# Altium schematic sheet GSHT_V1.4.SchDoc
size A4
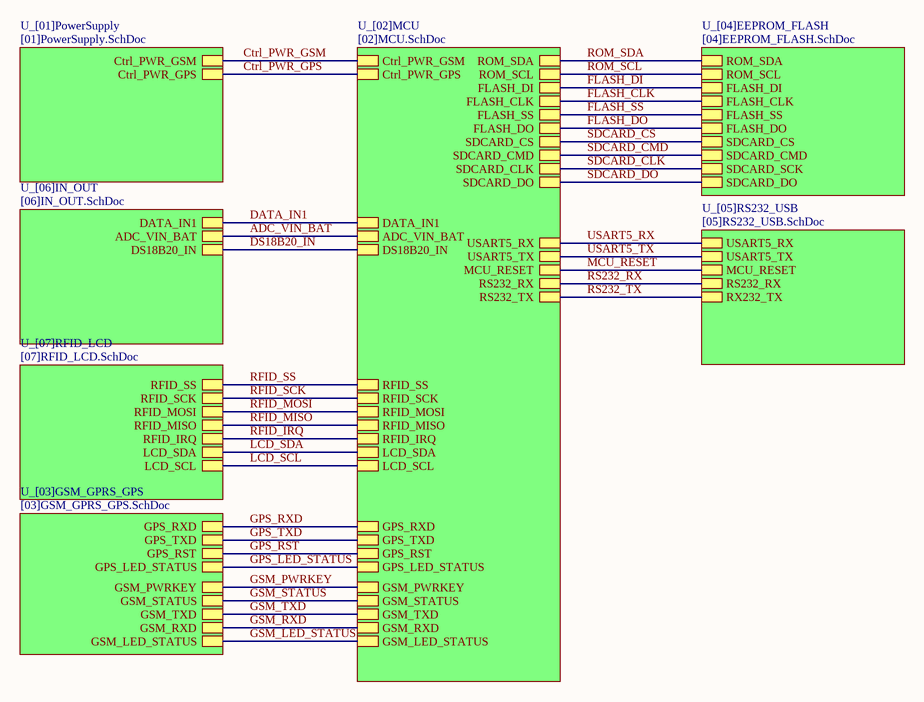
[diagram p0: GSHT_V1.4.SchDoc]

## Sub-sheets
U_[01]PowerSupply = [01]PowerSupply.SchDoc: Ctrl_PWR_GSM, Ctrl_PWR_GPS
U_[02]MCU = [02]MCU.SchDoc: GSM_STATUS, GSM_PWRKEY, DATA_IN1, GPS_RXD, GPS_TXD, GPS_RST, Ctrl_PWR_GPS, GSM_RXD, GSM_TXD, Ctrl_PWR_GSM, GSM_LED_STATUS, RS232_TX, RS232_RX, ADC_VIN_BAT, DS18B20_IN, RFID_SS, RFID_SCK, RFID_MOSI, RFID_MISO, LCD_SCL, LCD_SDA, ROM_SCL, ROM_SDA, RFID_IRQ, MCU_RESET, FLASH_DI, FLASH_DO, FLASH_CLK, FLASH_SS, SDCARD_CMD, SDCARD_DO, SDCARD_CLK, SDCARD_CS, GPS_LED_STATUS, USART5_TX, USART5_RX
U_[03]GSM_GPRS_GPS = [03]GSM_GPRS_GPS.SchDoc: GPS_RXD, GPS_TXD, GPS_RST, GSM_STATUS, GSM_RXD, GSM_TXD, GSM_PWRKEY, GSM_LED_STATUS, GPS_LED_STATUS
U_[04]EEPROM_FLASH = [04]EEPROM_FLASH.SchDoc: ROM_SDA, ROM_SCL, FLASH_DI, FLASH_CLK, FLASH_SS, FLASH_DO, SDCARD_CS, SDCARD_CMD, SDCARD_SCK, SDCARD_DO
U_[05]RS232_USB = [05]RS232_USB.SchDoc: USART5_RX, USART5_TX, MCU_RESET, RS232_RX, RX232_TX
U_[06]IN_OUT = [06]IN_OUT.SchDoc: DATA_IN1, ADC_VIN_BAT, DS18B20_IN
U_[07]RFID_LCD = [07]RFID_LCD.SchDoc: RFID_SS, RFID_SCK, RFID_MOSI, RFID_MISO, LCD_SDA, LCD_SCL, RFID_IRQ

## Nets
ADC_VIN_BAT: sheet U_[02]MCU/ADC_VIN_BAT, sheet U_[06]IN_OUT/ADC_VIN_BAT
Ctrl_PWR_GPS: sheet U_[01]PowerSupply/Ctrl_PWR_GPS, sheet U_[02]MCU/Ctrl_PWR_GPS
Ctrl_PWR_GSM: sheet U_[01]PowerSupply/Ctrl_PWR_GSM, sheet U_[02]MCU/Ctrl_PWR_GSM
DATA_IN1: sheet U_[02]MCU/DATA_IN1, sheet U_[06]IN_OUT/DATA_IN1
DS18B20_IN: sheet U_[02]MCU/DS18B20_IN, sheet U_[06]IN_OUT/DS18B20_IN
FLASH_CLK: sheet U_[02]MCU/FLASH_CLK, sheet U_[04]EEPROM_FLASH/FLASH_CLK
FLASH_DI: sheet U_[02]MCU/FLASH_DI, sheet U_[04]EEPROM_FLASH/FLASH_DI
FLASH_DO: sheet U_[02]MCU/FLASH_DO, sheet U_[04]EEPROM_FLASH/FLASH_DO
FLASH_SS: sheet U_[02]MCU/FLASH_SS, sheet U_[04]EEPROM_FLASH/FLASH_SS
GPS_LED_STATUS: sheet U_[02]MCU/GPS_LED_STATUS, sheet U_[03]GSM_GPRS_GPS/GPS_LED_STATUS
GPS_RST: sheet U_[02]MCU/GPS_RST, sheet U_[03]GSM_GPRS_GPS/GPS_RST
GPS_RXD: sheet U_[02]MCU/GPS_RXD, sheet U_[03]GSM_GPRS_GPS/GPS_RXD
GPS_TXD: sheet U_[02]MCU/GPS_TXD, sheet U_[03]GSM_GPRS_GPS/GPS_TXD
GSM_LED_STATUS: sheet U_[02]MCU/GSM_LED_STATUS, sheet U_[03]GSM_GPRS_GPS/GSM_LED_STATUS
GSM_PWRKEY: sheet U_[02]MCU/GSM_PWRKEY, sheet U_[03]GSM_GPRS_GPS/GSM_PWRKEY
GSM_RXD: sheet U_[02]MCU/GSM_RXD, sheet U_[03]GSM_GPRS_GPS/GSM_RXD
GSM_STATUS: sheet U_[02]MCU/GSM_STATUS, sheet U_[03]GSM_GPRS_GPS/GSM_STATUS
GSM_TXD: sheet U_[02]MCU/GSM_TXD, sheet U_[03]GSM_GPRS_GPS/GSM_TXD
LCD_SCL: sheet U_[02]MCU/LCD_SCL, sheet U_[07]RFID_LCD/LCD_SCL
LCD_SDA: sheet U_[02]MCU/LCD_SDA, sheet U_[07]RFID_LCD/LCD_SDA
MCU_RESET: sheet U_[02]MCU/MCU_RESET, sheet U_[05]RS232_USB/MCU_RESET
RFID_IRQ: sheet U_[02]MCU/RFID_IRQ, sheet U_[07]RFID_LCD/RFID_IRQ
RFID_MISO: sheet U_[02]MCU/RFID_MISO, sheet U_[07]RFID_LCD/RFID_MISO
RFID_MOSI: sheet U_[02]MCU/RFID_MOSI, sheet U_[07]RFID_LCD/RFID_MOSI
RFID_SCK: sheet U_[02]MCU/RFID_SCK, sheet U_[07]RFID_LCD/RFID_SCK
RFID_SS: sheet U_[02]MCU/RFID_SS, sheet U_[07]RFID_LCD/RFID_SS
ROM_SCL: sheet U_[02]MCU/ROM_SCL, sheet U_[04]EEPROM_FLASH/ROM_SCL
ROM_SDA: sheet U_[02]MCU/ROM_SDA, sheet U_[04]EEPROM_FLASH/ROM_SDA
RS232_RX: sheet U_[02]MCU/RS232_RX, sheet U_[05]RS232_USB/RS232_RX
RS232_TX: sheet U_[02]MCU/RS232_TX, sheet U_[05]RS232_USB/RX232_TX
SDCARD_CLK: sheet U_[02]MCU/SDCARD_CLK, sheet U_[04]EEPROM_FLASH/SDCARD_SCK
SDCARD_CMD: sheet U_[02]MCU/SDCARD_CMD, sheet U_[04]EEPROM_FLASH/SDCARD_CMD
SDCARD_CS: sheet U_[02]MCU/SDCARD_CS, sheet U_[04]EEPROM_FLASH/SDCARD_CS
SDCARD_DO: sheet U_[02]MCU/SDCARD_DO, sheet U_[04]EEPROM_FLASH/SDCARD_DO
USART5_RX: sheet U_[02]MCU/USART5_RX, sheet U_[05]RS232_USB/USART5_RX
USART5_TX: sheet U_[02]MCU/USART5_TX, sheet U_[05]RS232_USB/USART5_TX